# Altium schematic sheet Power.SchDoc
size A4
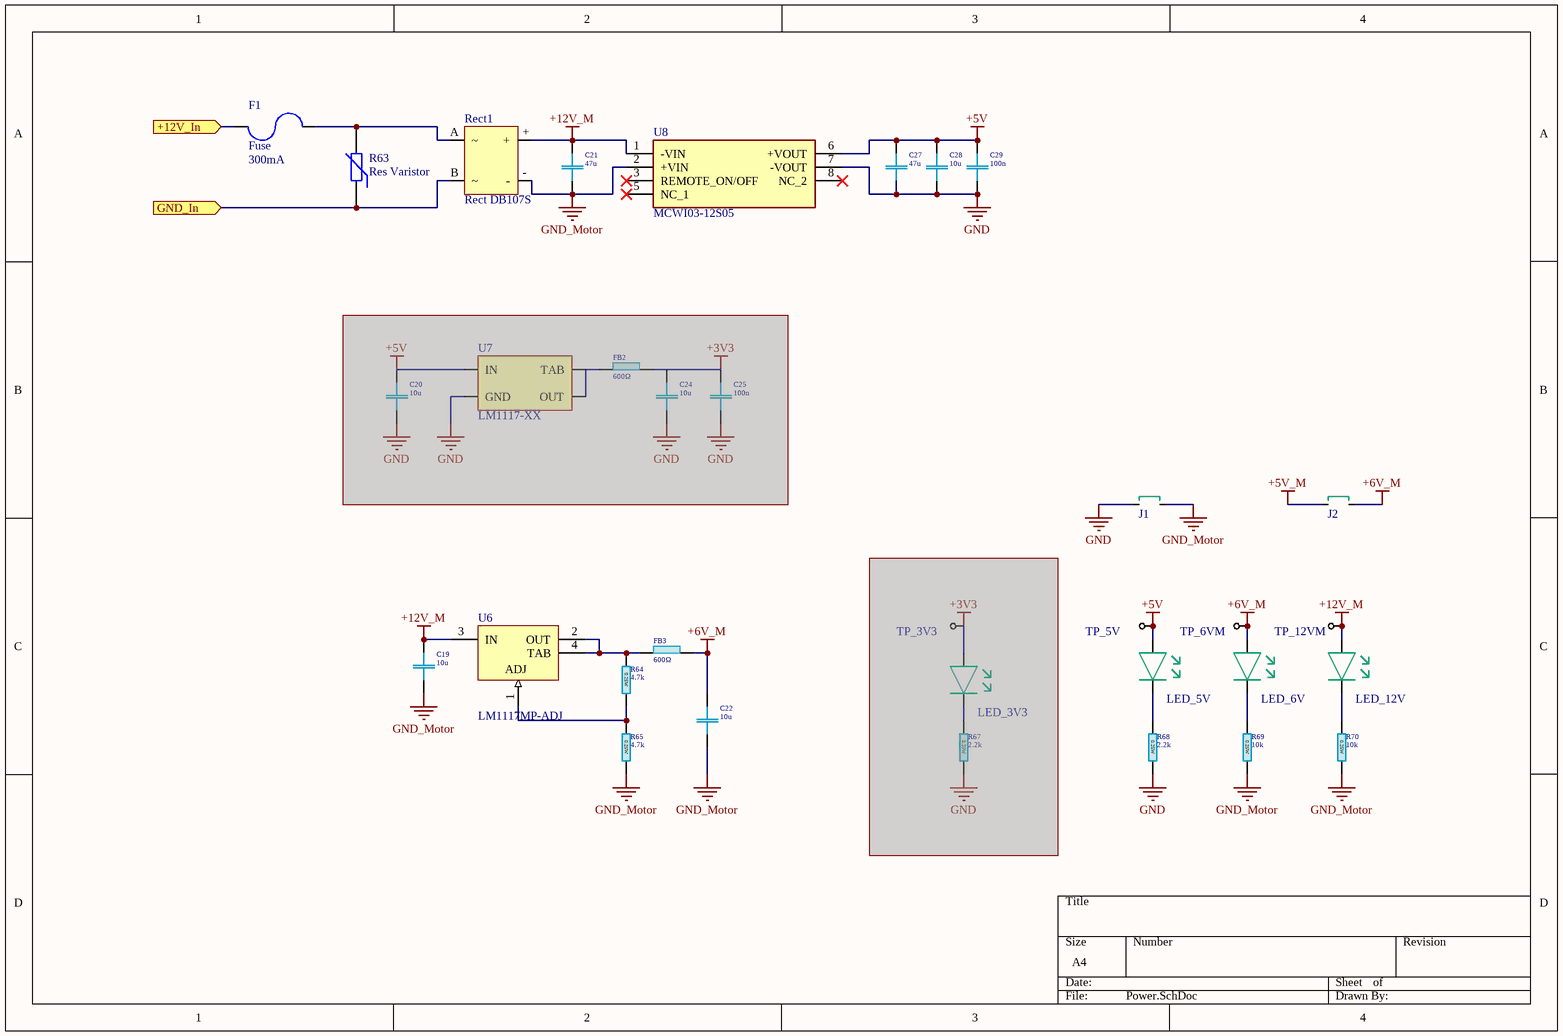
[diagram p0: Power.SchDoc]

## Parts
C19  10u  [C1206]
C20  10u  [C1206]  (masked out: inside a compile mask, not in the netlist)
C21  47u  [C1206]
C22  10u  [C1206]
C24  10u  [C1206]  (masked out: inside a compile mask, not in the netlist)
C25  100n  [C1206]  (masked out: inside a compile mask, not in the netlist)
C27  47u  [C1206]
C28  10u  [C1206]
C29  100n  [C1206]
F1  Fuse  value 300mA  [R1206]
FB2  ZTyp@100MHz: 600Ω  [L1206]  (hidden comment: 0.955u)  (masked out: inside a compile mask, not in the netlist)
FB3  ZTyp@100MHz: 600Ω  [L1206]  (hidden comment: 0.955u)
J1  Jumper  [JUMPER2]  (value not drawn)
J2  Jumper  [JUMPER2]  (value not drawn)
LED_3V3  LED  [LED 1206]  (value not drawn)  (masked out: inside a compile mask, not in the netlist)
LED_5V  LED  [LED 1206]  (value not drawn)
LED_6V  LED  [LED 1206]  (value not drawn)
LED_12V  LED  [LED 1206]  (value not drawn)
R63  Res Varistor  [BOURNS_MOV-07D431K_0]
R64  4.7k  [R1206]
R65  4.7k  [R1206]
R67  2.2k  [R1206]  (masked out: inside a compile mask, not in the netlist)
R68  2.2k  [R1206]
R69  10k  [R1206]
R70  10k  [R1206]
Rect1  Rect DB107S  [DB107S]
TP_3V3  Test Point  [Test Point Small]  (value not drawn)  (masked out: inside a compile mask, not in the netlist)
TP_5V  Test Point  [Test Point Small]  (value not drawn)
TP_6VM  Test Point  [Test Point Small]  (value not drawn)
TP_12VM  Test Point  [Test Point Small]  (value not drawn)
U6  LM1117MP-ADJ  [MP04A_N]
U7  LM1117-XX  [SOT230-LM1117-xx]  (masked out: inside a compile mask, not in the netlist)
U8  MCWI03-12S05  [MCWI0312S05]

## Ports
+12V_In (in), GND_In (in)

## Nets
+5V: C27.1 C28.1 C29.1 LED_5V.A TP_5V.1(T) U8.6(+VOUT)
+5V_M: J2.1
+6V_M: C22.1 FB3.2 J2.2 LED_6V.A TP_6VM.1(T)
+12V_M: C19.1 C21.1 LED_12V.A Rect1.+ TP_12VM.1(T) U6.3(IN) U8.1(-VIN)
GND: C27.2 C28.2 C29.2 J1.1 R68.2 U8.7(-VOUT)
GND_Motor: C19.2 C21.2 C22.2 J1.2 R65.2 R69.2 R70.2 Rect1.- U8.2(+VIN)
+12V_In: F1.1 ; port +12V_In
GND_In: R63.1 Rect1.B ; port GND_In
NetF1_2: F1.2 R63.2 Rect1.A
NetFB3_1: FB3.1 R64.1 U6.2(OUT) U6.4(TAB)
NetLED_5V_K: LED_5V.K R68.1
NetLED_6V_K: LED_6V.K R69.1
NetLED_12V_K: LED_12V.K R70.1
NetR64_2: R64.2 R65.1 U6.1(ADJ)

Not connected (* = marked no-connect by the designer): U8 3(REMOTE_ON/OFF)* 5(NC_1)* 8(NC_2)*

## Library data of the parts
C19-C22 C24 C25 C27-C29 = C 1206  100V X7R - 100n: SMD 1206   100V X7R 10%; Part Number: CL31B104KCFNNNE; Manufacturer: Samsung; TYPE: Capacitors; Package-mm: 3216; Mount Type: SMT; Publisher: Hefest; Manufacturer Alternate: *; Part Number Alternate: *; Published: 07.04.2019; Supplier 1: Comet; Supplier Part Number 1: C1206 100nF 100V X7R SAMSUNG; RoHS: Y; Technology: Ceramic  MLCC; Package: 1206; VDC: 100V; TempCo: X7R; Tolerance %: ±10%; VAC: *; ESR Ohm: *; ComponentLink1Description: Datasheet Link; ComponentLink1URL: https://store.comet.bg/download-file.php?id=11; Temperature Range: -55°C ~ +125°C; Price: 0.090; ComponentLink2Description: Characteristics data; ComponentLink2URL: https://store.comet.bg/download-file.php?id=3821
  C19 C20 C22 C24 C28: Value: 10u
  C21 C27: Value: 47u
  C25 C29: Value: 100n
FB2 FB3 = FB BLM31P 600: SMD 1206 1.5A 600Ω/80mΩ; Part Number: BLM31PG601SN1L; Manufacturer: Murata; TYPE: Ferrite Bead; Ind: 0.955uH; DC Resistance: 80mΩ; Material: Ferrite; Package-mm: 3216; Tolerance %: ±25%; Temperature Range: -55°C ~ +125°C; Imax: 1.5A; Irms: *; Isat: *; Technology: Chip; Published: 07.04.2019; Publisher: Hefest; Mount Type: SMT; Package: 1206; ComponentLink1Description: Datasheet Link; ComponentLink1URL: https://store.comet.bg/download-file.php?id=5324; RoHS: Y; Ztyp@1GHz: *; Manufacturer Alternate: *; Supplier 1: Comet; Supplier Part Number 1: BLM31PG601SN1L; Part Number Alternate: *; Price: 0.161; Value: 0.955u
J1 J2 = Jumper: Jumper Wire; Manufacturer: Generic Components; Published: 1999
R63 = Res Varistor: Varistor (Voltage-Sensitive Resistor); Published: 24-Mar-1999; LatestRevisionDate: 29-May-2009; LatestRevisionNote: IPC-7351 Footprint Added.; PackageVersion: Mar-2003; PackageReference: 6-0805; Publisher: Altium Limited; PackageDescription: Chip Resistor 0805 Case Size; Code_IPC: RESC2012
R64 R65 R67-R70 = R 1206-5%: SMD 1206 0.25W   5% 200V; Manufacturer: YAGEO; TempCo: ±100ppm/°C; Package-mm: 3216; Value Code: 102; Part Number: *; Mount Type: SMT; Publisher: Hefest; Manufacturer Alternate: *; Published: 07.04.2019; Supplier 1: Comet; Supplier Part Number 1: R1206 1.0K 5% YAG/ASJ; RoHS: Y; Technology: Thick film; Package: 1206; VDC: 200V; Tolerance %: ±5%; ComponentLink1Description: Datasheet Link; ComponentLink1URL: https://store.comet.bg/download-file.php?id=140; Temperature Range: -55°C ~ +155°C; Price: 0.054; Part Number Alternate: *; TYPE: Resistor; Power: 0.25W
  R64 R65: Value: 4.7k
  R67 R68: Value: 2.2k
  R69 R70: Value: 10k
Rect1 = DB107S
U6 = LM1117MP-ADJ: 800mA Low-Dropout Linear Regulator, 4-pin SOT-223; Manufacturer: National Semiconductor; PackageTopMarking: XYTT*N03A; High-Reliability: Y; CompType: LDO IC; PowerWise: N; ComponentLink4Description: MP04A Package Page; Code_IPC: SOT223-4; PartNumber: LM1117MP-ADJ; ComponentLink1Description: Manufacturer URL; ComponentLink2Description: LM1117 Datasheet; DatasheetVersion: Apr-2006; ComponentLink3URL: http://www.national.com/pf/LM/LM1117.html; ComponentLink1URL: http://www.national.com/; Code_JEDEC: TO-261-AA; RevisionNote: SCH symbol layout adjusted; ComponentLink4URL: http://www.national.com/packaging/folders/mp04a.html; PackageReference: MP04A; ComponentLink3Description: LM1117 Web Page; PackageVersion: revB, Apr-2003; RoHS: N; PinCount: 4; ComponentLink2URL: http://www.national.com/ds/LM/LM1117.pdf; PackageDescription: Molded SOT-223, 6.50 x 3.56 x 1.6mm Body, 4 Lead, 2.3mm Pitch
U7 = LM1117-XX: voltage regulator
U8 = MCWI03-12S05: Power Supply; Manufacturer_Name: Minmax; Datasheet Link: https://minmax.cdistore.com/datasheets/minmax/MCWI03-R2-110412.pdf; Manufacturer_Part_Number: MCWI03-12S05